# Altium schematic sheet dainyuan.SchDoc
size A4; SheetNumber: 1; SheetTotal: 1
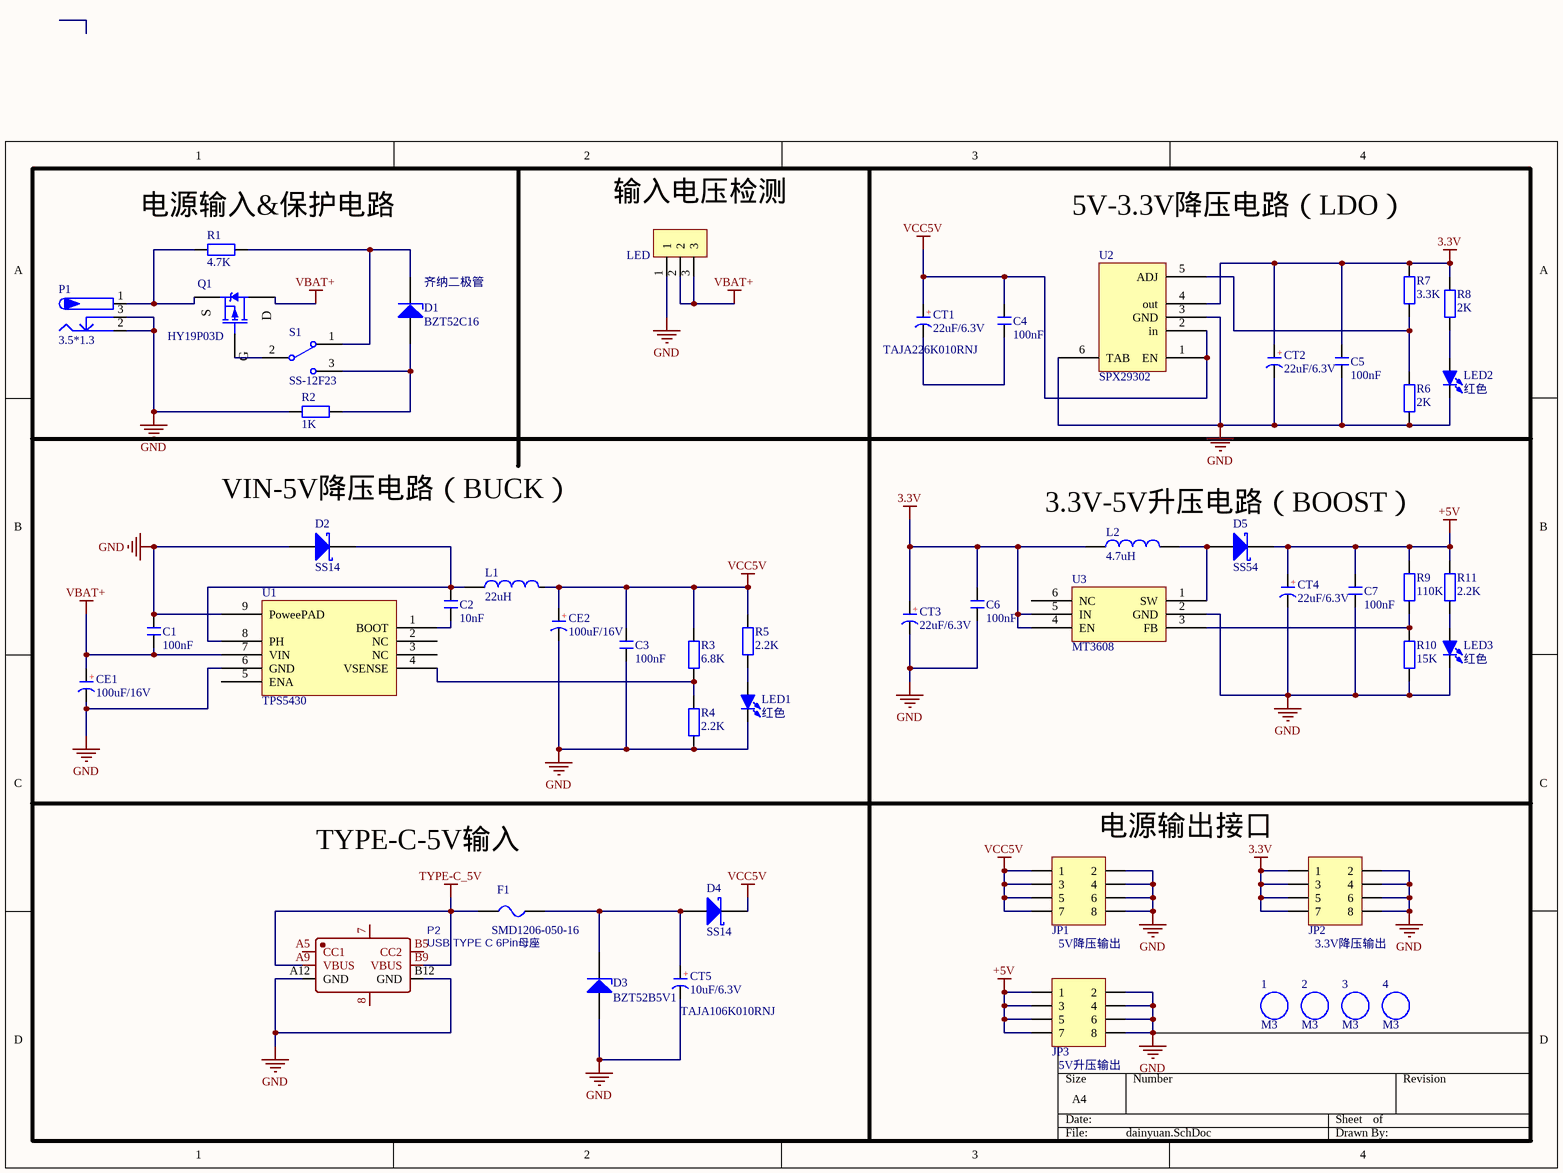
[diagram p0: dainyuan.SchDoc]

## Parts
1  M3  [M3 125X200]
2  M3  [M3 125X200]
3  M3  [M3 125X200]
4  M3  [M3 125X200]
C1  100nF  [C 0805_L]
C2  10nF  [C 0805_L]
C3  100nF  [C 0805_L]
C4  100nF  [C 0805_L]
C5  100nF  [C 0805_L]
C6  100nF  [C 0805_L]
C7  100nF  [C 0805_L]
CE1  100uF/16V  [CAP 3.5*8*11.5 - BK]
CE2  100uF/16V  [CAP 3.5*8*11.5 - BK]
CT1  22uF/6.3V  [CD A(3216)]
CT2  22uF/6.3V  [CD A(3216)]
CT3  22uF/6.3V  [CD A(3216)]
CT4  22uF/6.3V  [CD A(3216)]
CT5  10uF/6.3V  [CD A(3216)]
D1  BZT52C16  [SOD-123]
D2  SS14  [SMA]
D3  BZT52B5V1  [SOD-123]
D4  SS14  [SMA]
D5  SS54  [SMB]
F1  SMD1206-050-16  [FU 1206]
JP1  Header 4X2  [HDR2.54-LI-2x4P]  (value not drawn)
JP2  Header 4X2  [HDR2.54-LI-2x4P]  (value not drawn)
JP3  Header 4X2  [HDR2.54-LI-2x4P]  (value not drawn)
L1  22uH  [L-SMD-0630]
L2  4.7uH  [L-SMD-0630]
LED  HDR-1X3  [HDR2.54-M-LI-3P]  (value not drawn)
LED1  红色  [LED 0805R]
LED2  红色  [LED 0805R]
LED3  红色  [LED 0805R]
P1  3.5*1.3  [DC-005]
P2  USB TYPE C 6Pin母座  [USB-C-SMD_10P-P1.00-L6.8-W8.9]
Q1  HY19P03D  [TO252 - 3]
R1  4.7K  [R 0805_L]
R2  1K  [R 0805_L]
R3  6.8K  [R 0805_L]
R4  2.2K  [R 0805_L]
R5  2.2K  [R 0805_L]
R6  2K  [R 0805_L]
R7  3.3K  [R 0805_L]
R8  2K  [R 0805_L]
R9  110K  [R 0805_L]
R10  15K  [R 0805_L]
R11  2.2K  [R 0805_L]
S1  SS-12F23  [SS-12D10]
U1  TPS5430  [SOIC-8_EP]
U2  SPX29302  [TO263-5]
U3  MT3608  [SOT23-6]

## Nets
3.3V: C5.2 C6.2 CT2.1(A) CT3.1(A) JP2.1 JP2.3 JP2.5 JP2.7 L2.1 R7.2 R8.2 U2.4(out) U3.4(EN) U3.5(IN)
+5V: C7.2 CT4.1(A) D5.2(K) JP3.1 JP3.3 JP3.5 JP3.7 R9.2 R11.2
GND: C1.2 C3.1 C5.1 C6.1 C7.1 CE1.2(K) CE2.2(K) CT2.2(K) CT3.2(K) CT4.2(K) CT5.2(K) D2.1(A) D3.1(A) JP1.2 JP1.4 JP1.6 JP1.8 JP2.2 JP2.4 JP2.6 JP2.8 JP3.2 JP3.4 JP3.6 JP3.8 LED.1 LED1.2(K) LED2.2(K) LED3.2(K) P1.2 P1.3 P2.A12(GND) P2.B12(GND) R2.1 R4.1 R6.1 R10.1 U1.6(GND) U1.9(PoweePAD) U2.3(GND) U2.6(TAB) U3.2(GND)
TYPE-C_5V: F1.1 P2.A9(VBUS) P2.B9(VBUS)
VBAT+: C1.1 CE1.1(A) LED.2 LED.3 Q1.2(D) U1.7(VIN)
VCC5V: C3.2 C4.2 CE2.1(A) CT1.1(A) D4.2(K) JP1.1 JP1.3 JP1.5 JP1.7 L1.2 R3.2 R5.2 U2.1(EN) U2.2(in)
NetC2_1: C2.1 U1.1(BOOT)
NetC2_2: C2.2 D2.2(K) L1.1 U1.8(PH)
NetC4_1: C4.1 CT1.2(K)
NetCT5_1: CT5.1(A) D3.2(K) D4.1(A) F1.2
NetD1_1: D1.1(A) R2.2 S1.3
NetD1_2: D1.2(K) R1.2 S1.1
NetD5_1: D5.1(A) L2.2 U3.1(SW)
NetLED1_1: LED1.1(A) R5.1
NetLED2_1: LED2.1(A) R8.1
NetLED3_1: LED3.1(A) R11.1
NetP1_1: P1.1 Q1.3(S) R1.1
NetQ1_1: Q1.1(G) S1.2
NetR3_1: R3.1 R4.2 U1.4(VSENSE)
NetR6_2: R6.2 R7.1 U2.5(ADJ)
NetR9_1: R9.1 R10.2 U3.3(FB)

Not connected (* = marked no-connect by the designer): P2 7 8 A5(CC1) B5(CC2); U1 2(NC) 3(NC) 5(ENA); U3 6(NC)

## Notes on the sheet
- (near R1) 电源输入&保护电路
- (near LED) 输入电压检测
- 5V-3.3V降压电路（LDO）
- (near D1) 齐纳二极管
- (near CT1) TAJA226K010RNJ
- VIN-5V降压电路（BUCK）
- 3.3V-5V升压电路（BOOST）
- TYPE-C-5V输入
- (near JP1) 电源输出接口
- 5V降压输出
- 3.3V降压输出
- (near CT5) TAJA106K010RNJ
- (near JP3) 5V升压输出
- (in symbol CE) +
- (in symbol CT) +

## Library data of the parts
1-4 = M3: 铜柱孔; 优秀评价可免费更新: 联系淘宝ID：黄晶宝石，获取更新版封装库; 卖家免费技术支持，联系售后: 唯一出售店铺网址https://shop463601444.taobao.com; 封装库来自淘宝卖家 ID：黄晶宝石: 其他店铺购入均为盗版，请立即申请退款，本店提供现金奖励; BOM名称: 铜柱孔
C1-C7 = C: 贴片电容; BOM名称: 无极性贴片电容; 优秀评价可免费更新: 联系淘宝ID：黄晶宝石，获取更新版封装库; 卖家免费技术支持，联系售后: 唯一出售店铺网址https://shop463601444.taobao.com; 本封装库来自淘宝卖家 ID：黄晶宝石: 其他店铺购入均为盗版，请立即申请退款
CE1 CE2 = CE: 直插电解电容; 优秀评价可免费更新: 联系淘宝ID：黄晶宝石，获取更新版封装库; 卖家免费技术支持，联系售后: 唯一出售店铺网址https://shop463601444.taobao.com; 本封装库来自淘宝卖家 ID：黄晶宝石: 其他店铺购入均为盗版，请立即申请退款; BOM名称: 直插电解电容
CT1-CT5 = CT: 贴片钽电容; 优秀评价可免费更新: 联系淘宝ID：黄晶宝石，获取更新版封装库; 卖家免费技术支持，联系售后: 唯一出售店铺网址https://shop463601444.taobao.com; 本封装库来自淘宝卖家 ID：黄晶宝石: 其他店铺购入均为盗版，请立即申请退款; BOM名称: 贴片钽电容
D1 = 稳压二极管: Zener Diode（齐纳）; 卖家免费技术支持，联系售后: 唯一出售店铺网址https://shop463601444.taobao.com; 优秀评价可免费更新: 联系淘宝ID：黄晶宝石，获取更新版封装库; 封装库 来自淘宝卖家 ID：黄晶宝石: 其他店铺购入均为盗版，请立即申请退款
D2 D4 = SS14: 肖特基二极管; 属性: 40V/1A; 卖家免费技术支持，联系售后: 唯一出售店铺网址https://shop463601444.taobao.com; 优秀评价可免费更新: 联系淘宝ID：黄晶宝石，获取更新版封装库; 封装库 来自淘宝卖家 ID：黄晶宝石: 其他店铺购入均为盗版，请立即申请退款; BOM名称: 肖特基二极管
D3 = 稳压二极管: Zener Diode; 卖家免费技术支持，联系售后: 唯一出售店铺网址https://shop463601444.taobao.com; 优秀评价可免费更新: 联系淘宝ID：黄晶宝石，获取更新版封装库; 封装库 来自淘宝卖家 ID：黄晶宝石: 其他店铺购入均为盗版，请立即申请退款
D5 = SS54: 肖特基二极管
F1 = FU: 自恢复保险丝; BOM名称: 贴片保险丝; 版权归属: 封装库来自淘宝卖家 ID：黄晶宝石; 优秀评价可免费更新: 联系淘宝ID：黄晶宝石，获取更新版封装库; 卖家免费技术支持，联系售后: 唯一出售店铺网址https://shop463601444.taobao.com; 封装库来自淘宝卖家 ID：黄晶宝石: 其他店铺购入均为盗版，请立即申请退款
JP1-JP3 = Header 4X2: 4*2P接插件; 版权归属: 封装库来自淘宝 ID：黄晶宝石; 优秀评价可免费更新: 联系淘宝ID：黄晶宝石，获取更新版封装库; 卖家免费技术支持，联系售后: 唯一出售店铺网址https://shop463601444.taobao.com; BOM名称: 4*2P接插件
L1 L2 = L: 小功率贴片电感; 优秀评价可免费更新: 联系淘宝ID：黄晶宝石，获取更新版封装库; 卖家免费技术支持，联系售后: 唯一出售店铺网址https://shop463601444.taobao.com; 本封装库来自淘宝卖家 ID：黄晶宝石: 其他店铺购入均为盗版，请立即申请退款; BOM名称: 小功率贴片电感
LED = Header 3: 3P接插件; 版权归属: 封装库来自淘宝 ID：黄晶宝石; 优秀评价可免费更新: 联系淘宝ID：黄晶宝石，获取更新版封装库; 卖家免费技术支持，联系售后: 唯一出售店铺网址https://shop463601444.taobao.com; BOM名称: 3P接插件
LED1-LED3 = LED-SMD: 贴片LED; 优秀评价可免费更新: 联系淘宝ID：黄晶宝石，获取更新版封装库; 卖家免费技术支持，联系售后: 唯一出售店铺网址https://shop463601444.taobao.com; 封装库来自淘宝卖家 ID：黄晶宝石: 其他店铺购入均为假冒，请立即申请退款，本店奖励2~5元现金; BOM名称: 贴片LED
P1 = P-DC: 低压电源接口; BOM名称: DC电源接口; 版权归属: 封装库来自淘宝 ID：黄晶宝石; 学习资源: https://shop463601444.taobao.com
P2 = USB TYPE C 6Pin母座: BOM_Manufacturer: XUNPU; BOM_Manufacturer Part: TYC-252D-CB160; Contributor: LCSC; BOM_Supplier: LCSC; BOM_Supplier Part: C381473; spicePre: U; spiceSymbolName: TYC-252D-CB160
Q1 = IRF540: P沟场效应管; 卖家免费技术支持，联系售后: 唯一出售店铺网址https://shop463601444.taobao.com; 封装库来自淘宝卖家 ID：黄晶宝石: 其他店铺购入均为假冒，请申请退款，本店现金奖励; BOM名称: P沟场效应管
R1-R11 = R: 贴片电阻; 优秀评价可免费更新: 联系淘宝ID：黄晶宝石，获取更新版封装库; 卖家免费技术支持，联系售后: 唯一出售店铺网址https://shop463601444.taobao.com; 本封装库来自淘宝卖家 ID：黄晶宝石: 其他店铺购入均为盗版，请立即申请退款; BOM名称: 贴片电阻
S1 = SSW-1P: 1路波动开关; BOM名称: 波动开关; 版权归属: 封装库来自淘宝 ID：黄晶宝石; 优秀评价可免费更新: 联系淘宝ID：黄晶宝石，获取更新版封装库; 卖家免费技术支持，联系售后: 唯一出售店铺网址https://shop463601444.taobao.com; 本封装库来自淘宝卖家 ID：黄晶宝石: 其他店铺购入均为盗版，请立即申请退款
U1 = TPS5430: DC可调降压
U2 = SPX29302: LDO线性稳压芯片
U3 = MT3608: DC升压芯片